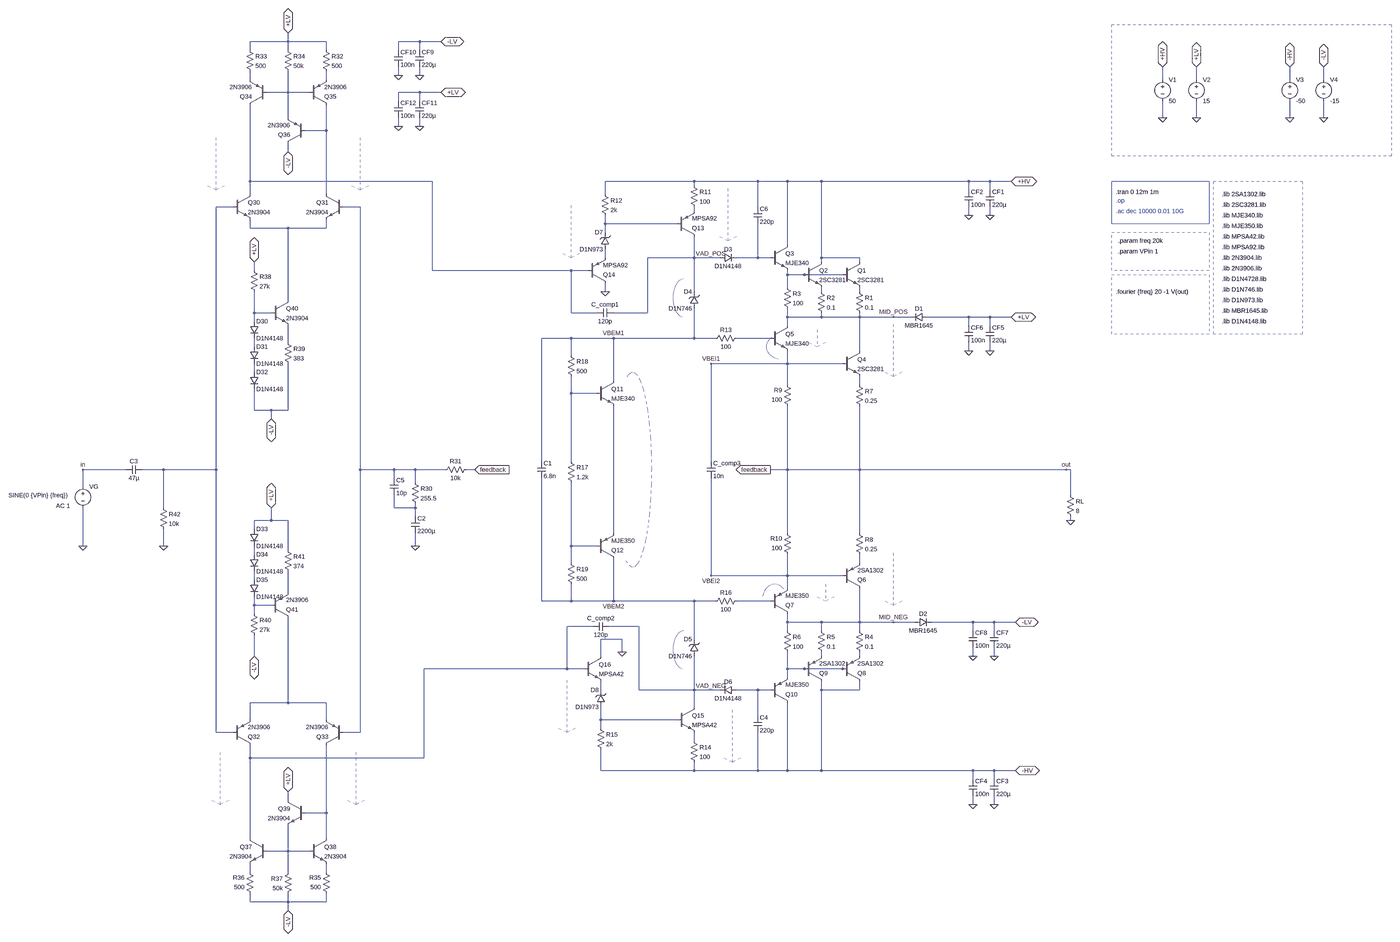
[diagram p0: schematic amplifier_V0.3.asc, whole sheet]
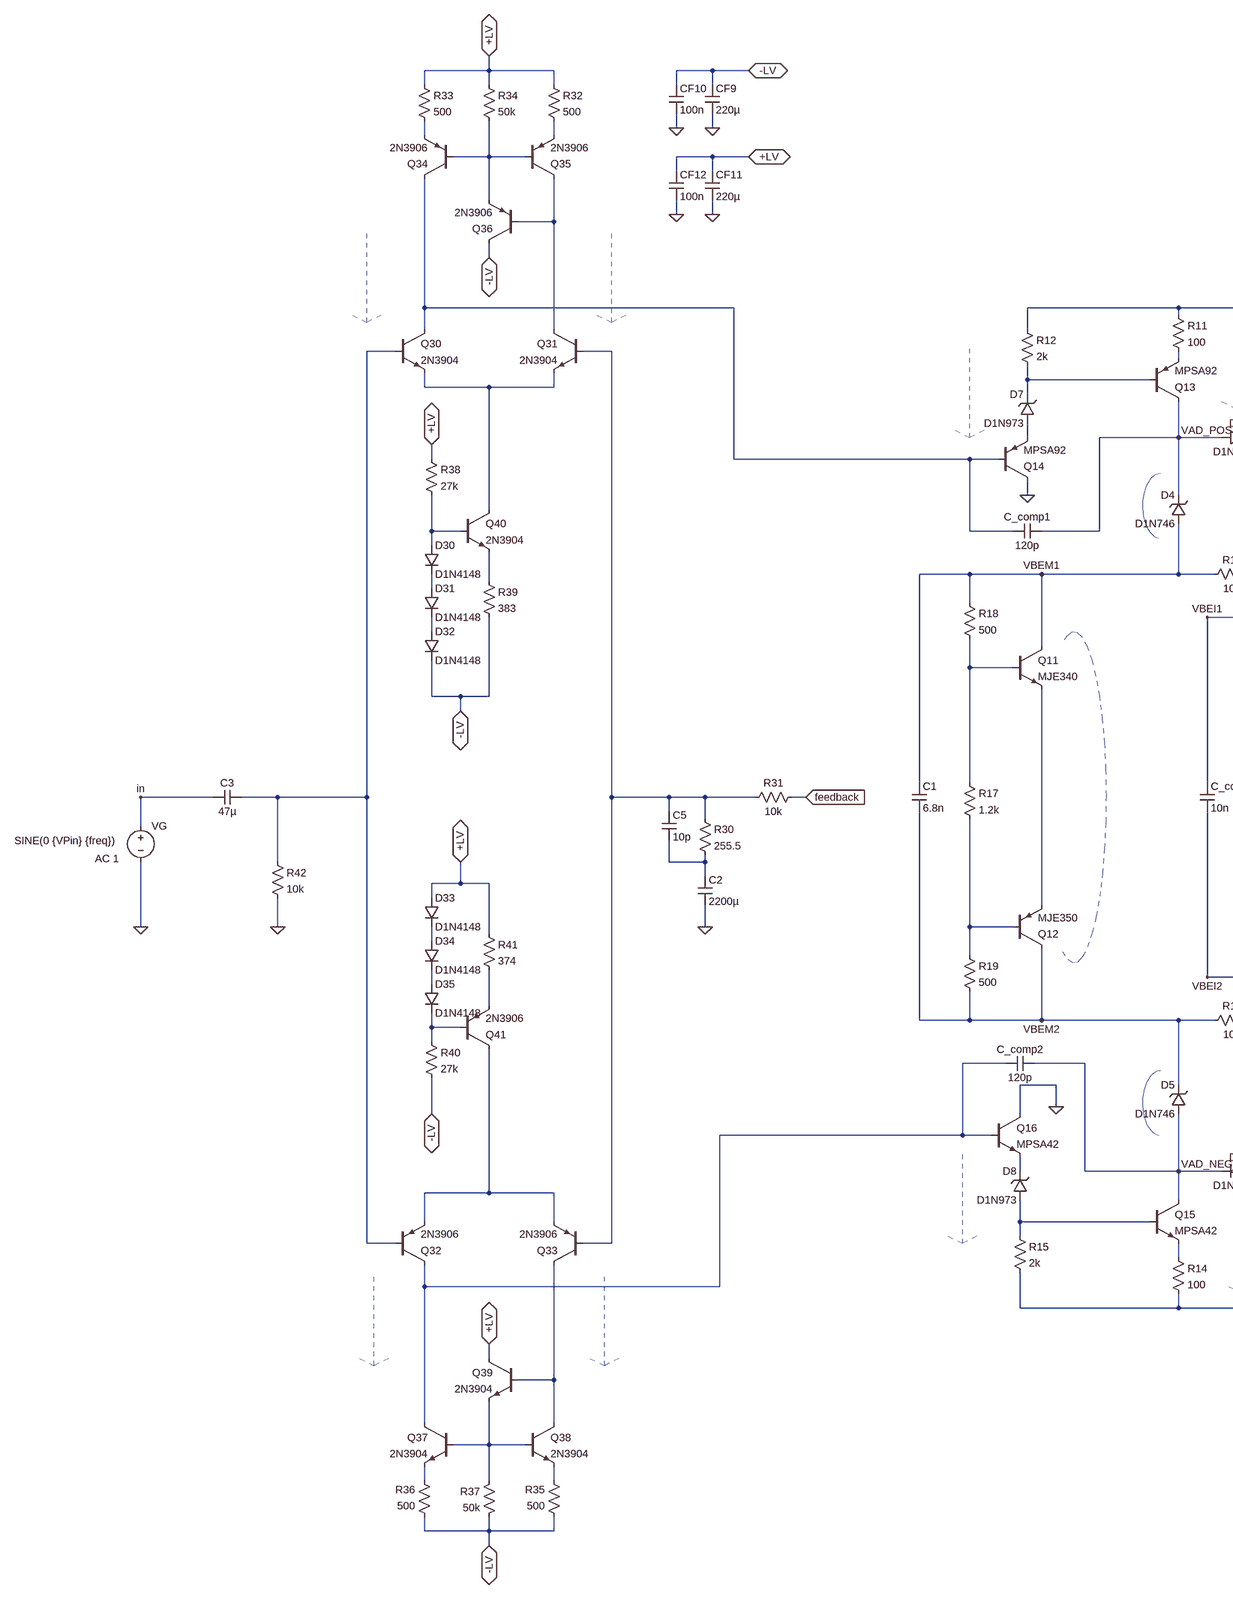
[diagram p1: schematic amplifier_V0.3.asc, part, row 1 of 1, column 1 of 2]
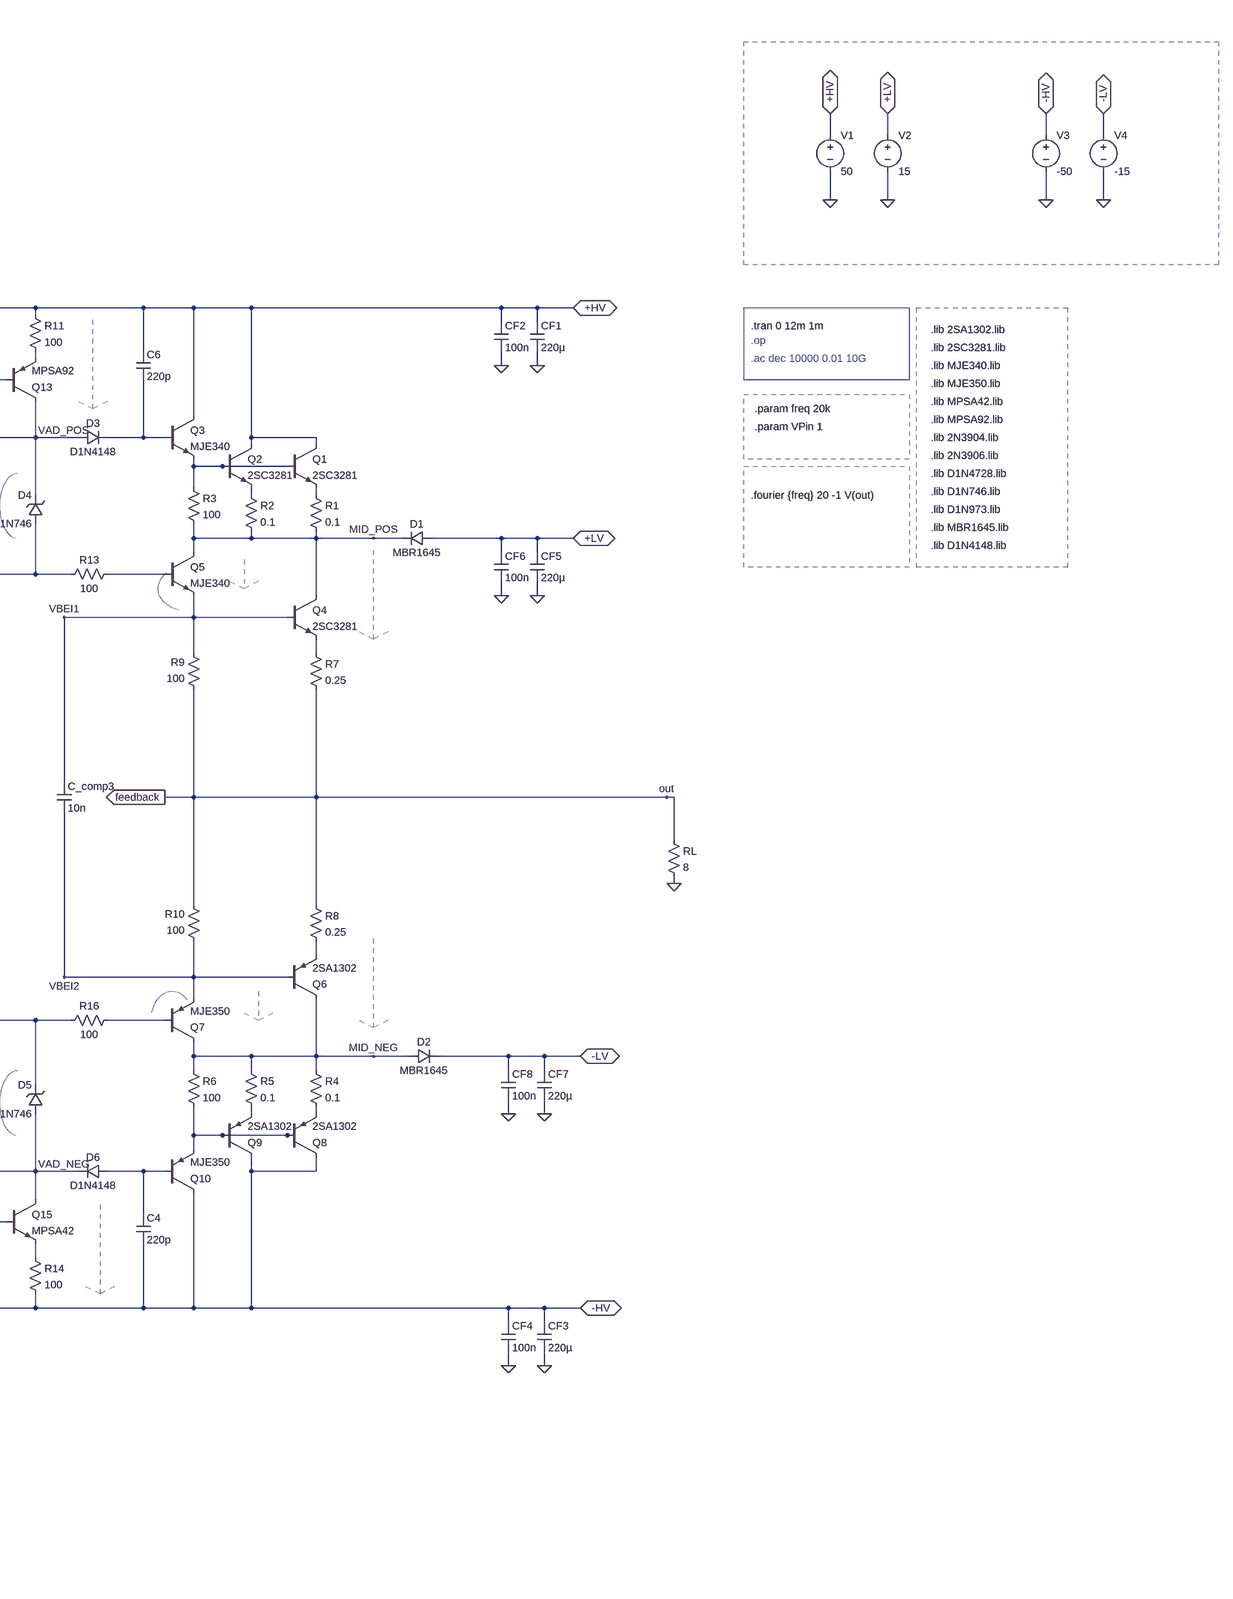
[diagram p2: schematic amplifier_V0.3.asc, part, row 1 of 1, column 2 of 2]
amplifier_V0.3.asc, the LTspice schematic file:
Version 4
SHEET 1 2964 1888
WIRE -2016 -1488 -2016 -1520
WIRE -2016 -1488 -2160 -1488
WIRE -1872 -1488 -2016 -1488
WIRE -1520 -1488 -1600 -1488
WIRE -1440 -1488 -1520 -1488
WIRE -2160 -1456 -2160 -1488
WIRE -2016 -1456 -2016 -1488
WIRE -1872 -1456 -1872 -1488
WIRE -1600 -1456 -1600 -1488
WIRE -1520 -1456 -1520 -1488
WIRE -1600 -1360 -1600 -1392
WIRE -1520 -1360 -1520 -1392
WIRE -2160 -1344 -2160 -1376
WIRE -1872 -1344 -1872 -1376
WIRE 1920 -1344 1920 -1392
WIRE 2048 -1344 2048 -1392
WIRE 2400 -1344 2400 -1392
WIRE 2528 -1344 2528 -1392
WIRE -2016 -1296 -2016 -1376
WIRE -2016 -1296 -2096 -1296
WIRE -1936 -1296 -2016 -1296
WIRE -1520 -1296 -1600 -1296
WIRE -1440 -1296 -1520 -1296
WIRE -1600 -1264 -1600 -1296
WIRE -1520 -1264 -1520 -1296
WIRE -2016 -1200 -2016 -1296
WIRE 1920 -1200 1920 -1264
WIRE 2048 -1200 2048 -1264
WIRE 2400 -1200 2400 -1264
WIRE 2528 -1200 2528 -1264
WIRE -1600 -1168 -1600 -1200
WIRE -1520 -1168 -1520 -1200
WIRE -1872 -1152 -1872 -1248
WIRE -1872 -1152 -1952 -1152
WIRE -2016 -1072 -2016 -1104
WIRE -2160 -960 -2160 -1248
WIRE -1472 -960 -2160 -960
WIRE -304 -960 -640 -960
WIRE -64 -960 -304 -960
WIRE 48 -960 -64 -960
WIRE 176 -960 48 -960
WIRE 912 -960 176 -960
WIRE 992 -960 912 -960
WIRE 1072 -960 992 -960
WIRE -304 -944 -304 -960
WIRE 912 -928 912 -960
WIRE 992 -928 992 -960
WIRE -2160 -912 -2160 -960
WIRE -1872 -912 -1872 -1152
WIRE -640 -912 -640 -960
WIRE -2224 -864 -2288 -864
WIRE -1744 -864 -1808 -864
WIRE -64 -864 -64 -960
WIRE -304 -848 -304 -864
WIRE 912 -832 912 -864
WIRE 992 -832 992 -864
WIRE -640 -800 -640 -832
WIRE -368 -800 -640 -800
WIRE -2160 -784 -2160 -816
WIRE -2016 -784 -2160 -784
WIRE -1872 -784 -1872 -816
WIRE -1872 -784 -2016 -784
WIRE -640 -768 -640 -800
WIRE 48 -720 48 -960
WIRE -640 -672 -640 -704
WIRE -304 -672 -304 -752
WIRE -304 -672 -480 -672
WIRE -208 -672 -304 -672
WIRE -64 -672 -64 -800
WIRE -64 -672 -144 -672
WIRE -16 -672 -64 -672
WIRE 176 -672 176 -960
WIRE 320 -672 176 -672
WIRE 176 -656 176 -672
WIRE 320 -656 320 -672
WIRE -2144 -624 -2144 -656
WIRE -1472 -624 -1472 -960
WIRE -768 -624 -1472 -624
WIRE -704 -624 -768 -624
WIRE 48 -608 48 -624
WIRE 112 -608 48 -608
WIRE 256 -608 112 -608
WIRE 48 -560 48 -608
WIRE -640 -544 -640 -576
WIRE -304 -544 -304 -672
WIRE 176 -544 176 -560
WIRE 320 -544 320 -560
WIRE -2016 -512 -2016 -784
WIRE -2144 -464 -2144 -544
WIRE -2080 -464 -2144 -464
WIRE -768 -464 -768 -624
WIRE -672 -464 -768 -464
WIRE -480 -464 -480 -672
WIRE -480 -464 -608 -464
WIRE 48 -448 48 -480
WIRE 176 -448 176 -464
WIRE 176 -448 48 -448
WIRE 320 -448 320 -464
WIRE 320 -448 176 -448
WIRE 448 -448 320 -448
WIRE 512 -448 448 -448
WIRE 912 -448 576 -448
WIRE 992 -448 912 -448
WIRE 1072 -448 992 -448
WIRE -2144 -432 -2144 -464
WIRE 48 -416 48 -448
WIRE 912 -416 912 -448
WIRE 992 -416 992 -448
WIRE -768 -368 -880 -368
WIRE -608 -368 -768 -368
WIRE -304 -368 -304 -480
WIRE -304 -368 -608 -368
WIRE -224 -368 -304 -368
WIRE -16 -368 -144 -368
WIRE -2016 -352 -2016 -416
WIRE -2144 -336 -2144 -368
WIRE 320 -320 320 -448
WIRE 912 -320 912 -352
WIRE 992 -320 992 -352
WIRE -768 -304 -768 -368
WIRE 48 -272 48 -320
WIRE 48 -272 -240 -272
WIRE 256 -272 48 -272
WIRE -2144 -240 -2144 -272
WIRE -608 -208 -608 -368
WIRE 48 -192 48 -272
WIRE 320 -192 320 -224
WIRE -768 -160 -768 -224
WIRE -672 -160 -768 -160
WIRE -2144 -96 -2144 -176
WIRE -2080 -96 -2144 -96
WIRE -2016 -96 -2016 -272
WIRE -2016 -96 -2080 -96
WIRE -2080 -64 -2080 -96
WIRE -880 96 -880 -368
WIRE -768 96 -768 -160
WIRE -240 96 -240 -272
WIRE -2640 128 -2912 128
WIRE -2496 128 -2576 128
WIRE -2288 128 -2288 -864
WIRE -2288 128 -2496 128
WIRE -1744 128 -1744 -864
WIRE -1616 128 -1744 128
WIRE -1536 128 -1616 128
WIRE -1424 128 -1536 128
WIRE -1312 128 -1344 128
WIRE 48 128 48 -112
WIRE 48 128 -16 128
WIRE 320 128 320 -112
WIRE 320 128 48 128
WIRE 1280 128 320 128
WIRE 1296 128 1280 128
WIRE -1616 160 -1616 128
WIRE -1536 176 -1536 128
WIRE -2912 192 -2912 128
WIRE 1296 224 1296 128
WIRE -2496 272 -2496 128
WIRE -1616 272 -1616 224
WIRE -1536 272 -1536 256
WIRE -1536 272 -1616 272
WIRE -1536 304 -1536 272
WIRE -2080 320 -2080 272
WIRE -2080 320 -2144 320
WIRE -2016 320 -2080 320
WIRE 1296 320 1296 304
WIRE -2144 352 -2144 320
WIRE -608 368 -608 -112
WIRE 48 368 48 128
WIRE 320 368 320 128
WIRE -2912 416 -2912 272
WIRE -2496 416 -2496 352
WIRE -1536 416 -1536 368
WIRE -768 416 -768 176
WIRE -672 416 -768 416
WIRE -2016 432 -2016 320
WIRE -2144 448 -2144 416
WIRE -768 480 -768 416
WIRE 320 480 320 448
WIRE -240 528 -240 160
WIRE 48 528 48 448
WIRE 48 528 -240 528
WIRE 256 528 48 528
WIRE -2144 544 -2144 512
WIRE 48 576 48 528
WIRE -2016 592 -2016 512
WIRE -880 624 -880 160
WIRE -768 624 -768 560
WIRE -768 624 -880 624
WIRE -608 624 -608 464
WIRE -608 624 -768 624
WIRE -304 624 -608 624
WIRE -224 624 -304 624
WIRE -16 624 -144 624
WIRE -2144 640 -2144 608
WIRE -2080 640 -2144 640
WIRE -2144 672 -2144 640
WIRE 48 704 48 672
WIRE 176 704 48 704
WIRE 320 704 320 576
WIRE 320 704 176 704
WIRE 448 704 320 704
WIRE 528 704 448 704
WIRE 928 704 592 704
WIRE 1008 704 928 704
WIRE 1088 704 1008 704
WIRE -688 720 -784 720
WIRE -512 720 -624 720
WIRE 48 736 48 704
WIRE 176 736 176 704
WIRE 320 736 320 704
WIRE 928 736 928 704
WIRE 1008 736 1008 704
WIRE -576 768 -656 768
WIRE -304 768 -304 624
WIRE -576 816 -576 768
WIRE -2144 832 -2144 752
WIRE -656 832 -656 768
WIRE 176 832 176 816
WIRE 320 832 320 816
WIRE 928 832 928 800
WIRE 1008 832 1008 800
WIRE -784 880 -784 720
WIRE -784 880 -1504 880
WIRE -720 880 -784 880
WIRE 48 880 48 816
WIRE 112 880 48 880
WIRE 256 880 112 880
WIRE 272 880 256 880
WIRE 48 912 48 880
WIRE -656 960 -656 928
WIRE -512 960 -512 720
WIRE -304 960 -304 832
WIRE -304 960 -512 960
WIRE -208 960 -304 960
WIRE -64 960 -144 960
WIRE -16 960 -64 960
WIRE 176 960 176 928
WIRE 320 960 320 928
WIRE 320 960 176 960
WIRE -2016 1008 -2016 688
WIRE -2016 1008 -2160 1008
WIRE -1872 1008 -2016 1008
WIRE -304 1024 -304 960
WIRE -64 1056 -64 960
WIRE -2160 1072 -2160 1008
WIRE -1872 1072 -1872 1008
WIRE -656 1072 -656 1024
WIRE -368 1072 -656 1072
WIRE -656 1104 -656 1072
WIRE -2288 1120 -2288 128
WIRE -2224 1120 -2288 1120
WIRE -1744 1120 -1744 128
WIRE -1744 1120 -1808 1120
WIRE -304 1152 -304 1120
WIRE -2160 1216 -2160 1168
WIRE -1504 1216 -1504 880
WIRE -1504 1216 -2160 1216
WIRE -656 1264 -656 1184
WIRE -304 1264 -304 1232
WIRE -304 1264 -656 1264
WIRE -64 1264 -64 1120
WIRE -64 1264 -304 1264
WIRE 48 1264 48 1008
WIRE 48 1264 -64 1264
WIRE 176 1264 176 960
WIRE 176 1264 48 1264
WIRE 928 1264 176 1264
WIRE 1008 1264 928 1264
WIRE 1088 1264 1008 1264
WIRE 928 1296 928 1264
WIRE 1008 1296 1008 1264
WIRE -2016 1376 -2016 1344
WIRE 928 1392 928 1360
WIRE 1008 1392 1008 1360
WIRE -1872 1424 -1872 1168
WIRE -1872 1424 -1952 1424
WIRE -2160 1520 -2160 1216
WIRE -1872 1520 -1872 1424
WIRE -2016 1568 -2016 1472
WIRE -2016 1568 -2096 1568
WIRE -1936 1568 -2016 1568
WIRE -2160 1648 -2160 1616
WIRE -2016 1648 -2016 1568
WIRE -1872 1648 -1872 1616
WIRE -2160 1760 -2160 1728
WIRE -2016 1760 -2016 1728
WIRE -2016 1760 -2160 1760
WIRE -1872 1760 -1872 1728
WIRE -1872 1760 -2016 1760
WIRE -2016 1792 -2016 1760
FLAG 1088 1264 -HV
IOPIN 1088 1264 BiDir
FLAG 1088 704 -LV
IOPIN 1088 704 BiDir
FLAG 1072 -960 +HV
IOPIN 1072 -960 BiDir
FLAG 1072 -448 +LV
IOPIN 1072 -448 BiDir
FLAG 1296 320 0
FLAG 1920 -1200 0
FLAG 2048 -1200 0
FLAG 2400 -1200 0
FLAG 2528 -1200 0
FLAG 1920 -1392 +HV
IOPIN 1920 -1392 BiDir
FLAG 2048 -1392 +LV
IOPIN 2048 -1392 BiDir
FLAG 2400 -1392 -HV
IOPIN 2400 -1392 BiDir
FLAG 2528 -1392 -LV
IOPIN 2528 -1392 BiDir
FLAG -608 -368 VBEM1
FLAG -608 624 VBEM2
FLAG 1280 128 out
FLAG -304 -672 VAD_POS
FLAG -304 960 VAD_NEG
FLAG 448 704 MID_NEG
FLAG 448 -448 MID_POS
FLAG -240 -272 VBEI1
FLAG -240 528 VBEI2
FLAG -2496 416 0
FLAG -1536 416 0
FLAG -2912 416 0
FLAG -640 -544 0
FLAG -576 816 0
FLAG -2016 -1520 +LV
IOPIN -2016 -1520 BiDir
FLAG -2016 1792 -LV
IOPIN -2016 1792 BiDir
FLAG -2016 1344 +LV
IOPIN -2016 1344 BiDir
FLAG -2016 -1072 -LV
IOPIN -2016 -1072 BiDir
FLAG -2912 128 in
FLAG -16 128 feedback
IOPIN -16 128 Out
FLAG -1312 128 feedback
IOPIN -1312 128 In
FLAG -2144 -656 +LV
IOPIN -2144 -656 BiDir
FLAG -2080 -64 -LV
IOPIN -2080 -64 BiDir
FLAG -2080 272 +LV
IOPIN -2080 272 BiDir
FLAG -2144 832 -LV
IOPIN -2144 832 BiDir
FLAG 912 -832 0
FLAG 992 -832 0
FLAG 928 1392 0
FLAG 1008 1392 0
FLAG 912 -320 0
FLAG 992 -320 0
FLAG 928 832 0
FLAG 1008 832 0
FLAG -1440 -1488 -LV
IOPIN -1440 -1488 BiDir
FLAG -1600 -1360 0
FLAG -1520 -1360 0
FLAG -1440 -1296 +LV
IOPIN -1440 -1296 BiDir
FLAG -1600 -1168 0
FLAG -1520 -1168 0
DATAFLAG 96 704 "round($*100)/100"
DATAFLAG 1184 128 ""
DATAFLAG 448 -304 "Ic(Q4)"
DATAFLAG 448 560 "-Ic(Q6)"
DATAFLAG -464 128 "V(vbem1)-V(vbem2)"
DATAFLAG 160 -368 "-Ie(Q5)"
DATAFLAG 192 592 "Ie(Q7)"
DATAFLAG -608 -288 "Ic(Q13)"
DATAFLAG -608 544 "Ic(Q12)"
DATAFLAG -384 -512 "V(vad_pos)-V(vbem1)"
DATAFLAG -384 816 "-(V(vad_neg)-V(vbem2))"
DATAFLAG -16 -304 "V(vbem1)-V(vbei1)"
DATAFLAG -32 576 "-(V(vbem2)-V(vbei2))"
DATAFLAG -448 624 ""
DATAFLAG -464 -368 ""
DATAFLAG -176 -832 "-Ic(Q13)"
DATAFLAG -160 1136 "Ic(Q15)"
DATAFLAG -768 -768 "Ie(Q14)"
DATAFLAG -480 1072 ""
DATAFLAG -784 1008 "-Ie(Q16)"
DATAFLAG -928 -624 ""
DATAFLAG -1008 880 ""
DATAFLAG -416 -672 ""
DATAFLAG -1744 -1024 "Ic(Q31)"
DATAFLAG -2288 -1024 "Ic(Q30)"
DATAFLAG -2016 -784 ""
DATAFLAG -2272 1296 "-Ic(Q32)"
DATAFLAG -2016 1008 ""
DATAFLAG -2160 1328 ""
DATAFLAG -1760 1296 "-Ic(Q33)"
DATAFLAG -1872 1344 ""
DATAFLAG -2160 -1040 ""
DATAFLAG -1872 -1040 ""
DATAFLAG -2000 -1296 ""
DATAFLAG -2016 -592 "Ic(Q40)"
DATAFLAG -2016 816 "-Ic(Q41)"
DATAFLAG -480 -800 ""
SYMBOL npn -16 -720 R0
SYMATTR InstName Q3
SYMATTR Value MJE340
SYMBOL res 32 -576 R0
SYMATTR InstName R3
SYMATTR Value 100
SYMBOL diode -208 -656 R270
WINDOW 0 32 32 VTop 2
WINDOW 3 0 32 VBottom 2
SYMATTR InstName D3
SYMATTR Value D1N4148
SYMBOL zener -288 -480 R180
WINDOW 0 24 64 Left 2
WINDOW 3 24 0 Left 2
SYMATTR InstName D4
SYMATTR Value D1N746
SYMBOL npn -16 -416 R0
SYMATTR InstName Q5
SYMATTR Value MJE340
SYMBOL res 304 -208 R0
SYMATTR InstName R7
SYMATTR Value 0.25
SYMBOL res 64 -96 R180
WINDOW 0 36 76 Left 2
WINDOW 3 36 40 Left 2
SYMATTR InstName R9
SYMATTR Value 100
SYMBOL res 304 352 R0
SYMATTR InstName R8
SYMATTR Value 0.25
SYMBOL pnp -16 672 M180
SYMATTR InstName Q7
SYMATTR Value MJE350
SYMBOL pnp -16 1008 M180
SYMATTR InstName Q10
SYMATTR Value MJE350
SYMBOL res 32 720 R0
SYMATTR InstName R6
SYMATTR Value 100
SYMBOL zener -288 832 R180
WINDOW 0 24 64 Left 2
WINDOW 3 24 0 Left 2
SYMATTR InstName D5
SYMATTR Value D1N746
SYMBOL diode -144 944 R90
WINDOW 0 0 32 VBottom 2
WINDOW 3 32 32 VTop 2
SYMATTR InstName D6
SYMATTR Value D1N4148
SYMBOL diode 528 720 R270
WINDOW 0 32 32 VTop 2
WINDOW 3 0 32 VBottom 2
SYMATTR InstName D2
SYMATTR Value MBR1645
SYMBOL res 64 464 R180
WINDOW 0 36 76 Left 2
WINDOW 3 36 40 Left 2
SYMATTR InstName R10
SYMATTR Value 100
SYMBOL res 304 720 R0
SYMATTR InstName R4
SYMATTR Value 0.1
SYMBOL res 160 720 R0
SYMATTR InstName R5
SYMATTR Value 0.1
SYMBOL res 160 -560 R0
SYMATTR InstName R2
SYMATTR Value 0.1
SYMBOL res 304 -560 R0
SYMATTR InstName R1
SYMATTR Value 0.1
SYMBOL res 1280 208 R0
SYMATTR InstName RL
SYMATTR Value 8
SYMBOL diode 576 -432 M270
WINDOW 0 32 32 VTop 2
WINDOW 3 0 32 VBottom 2
SYMATTR InstName D1
SYMATTR Value MBR1645
SYMBOL voltage 1920 -1360 R0
SYMATTR InstName V1
SYMATTR Value 50
SYMBOL voltage 2048 -1360 R0
SYMATTR InstName V2
SYMATTR Value 15
SYMBOL voltage 2400 -1360 R0
SYMATTR InstName V3
SYMATTR Value -50
SYMBOL voltage 2528 -1360 R0
SYMATTR InstName V4
SYMATTR Value -15
SYMBOL pnp -672 464 M180
SYMATTR InstName Q12
SYMATTR Value MJE350
SYMBOL npn -672 -208 R0
SYMATTR InstName Q11
SYMATTR Value MJE340
SYMBOL res -784 80 R0
SYMATTR InstName R17
SYMATTR Value 1.2k
SYMBOL res -784 -320 R0
SYMATTR InstName R18
SYMATTR Value 500
SYMBOL res -784 464 R0
SYMATTR InstName R19
SYMATTR Value 500
SYMBOL cap -256 96 R0
SYMATTR InstName C_comp3
SYMATTR Value 10n
SYMBOL res -128 -384 R90
WINDOW 0 0 56 VBottom 2
WINDOW 3 32 56 VTop 2
SYMATTR InstName R13
SYMATTR Value 100
SYMBOL res -128 608 R90
WINDOW 0 0 56 VBottom 2
WINDOW 3 32 56 VTop 2
SYMATTR InstName R16
SYMATTR Value 100
SYMBOL pnp -368 -752 M180
SYMATTR InstName Q13
SYMATTR Value MPSA92
SYMBOL npn -368 1024 R0
SYMATTR InstName Q15
SYMATTR Value MPSA42
SYMBOL cap -896 96 R0
SYMATTR InstName C1
SYMATTR Value 6.8n
SYMBOL voltage -2912 176 R0
WINDOW 3 -281 49 Left 2
WINDOW 123 -102 89 Left 2
WINDOW 39 0 0 Left 2
SYMATTR Value SINE(0 {VPin} {freq})
SYMATTR Value2 AC 1
SYMATTR InstName VG
SYMBOL npn -720 832 R0
SYMATTR InstName Q16
SYMATTR Value MPSA42
SYMBOL res -672 1088 R0
SYMATTR InstName R15
SYMATTR Value 2k
SYMBOL res -1552 160 R0
SYMATTR InstName R30
SYMATTR Value 255.5
SYMBOL res -1328 112 R90
WINDOW 0 0 56 VBottom 2
WINDOW 3 32 56 VTop 2
SYMATTR InstName R31
SYMATTR Value 10k
SYMBOL res -2512 256 R0
SYMATTR InstName R42
SYMATTR Value 10k
SYMBOL cap -1552 304 R0
SYMATTR InstName C2
SYMATTR Value 2200µ
SYMBOL cap -2576 112 R90
WINDOW 0 0 32 VBottom 2
WINDOW 3 32 32 VTop 2
SYMATTR InstName C3
SYMATTR Value 47µ
SYMBOL pnp -704 -576 M180
SYMATTR InstName Q14
SYMATTR Value MPSA92
SYMBOL res -656 -928 R0
SYMATTR InstName R12
SYMATTR Value 2k
SYMBOL zener -640 1024 R180
WINDOW 0 24 64 Left 2
WINDOW 3 24 0 Left 2
SYMATTR InstName D8
SYMATTR Value D1N973
SYMBOL zener -624 -704 R180
WINDOW 0 24 64 Left 2
WINDOW 3 24 0 Left 2
SYMATTR InstName D7
SYMATTR Value D1N973
SYMBOL npn -2224 -912 R0
SYMATTR InstName Q30
SYMATTR Value 2N3904
SYMBOL npn -1808 -912 M0
SYMATTR InstName Q31
SYMATTR Value 2N3904
SYMBOL pnp -2224 1168 M180
SYMATTR InstName Q32
SYMATTR Value 2N3906
SYMBOL pnp -1808 1168 R180
SYMATTR InstName Q33
SYMATTR Value 2N3906
SYMBOL cap -608 -480 R90
WINDOW 0 0 32 VBottom 2
WINDOW 3 32 32 VTop 2
SYMATTR InstName C_comp1
SYMATTR Value 120p
SYMBOL cap -624 704 R90
WINDOW 0 0 32 VBottom 2
WINDOW 3 32 32 VTop 2
SYMATTR InstName C_comp2
SYMATTR Value 120p
SYMBOL pnp -1936 -1248 M180
SYMATTR InstName Q35
SYMATTR Value 2N3906
SYMBOL pnp -2096 -1248 R180
SYMATTR InstName Q34
SYMATTR Value 2N3906
SYMBOL npn -2096 1520 M0
SYMATTR InstName Q37
SYMATTR Value 2N3904
SYMBOL npn -1936 1520 R0
SYMATTR InstName Q38
SYMATTR Value 2N3904
SYMBOL res -320 -960 R0
SYMATTR InstName R11
SYMATTR Value 100
SYMBOL res -320 1136 R0
SYMATTR InstName R14
SYMATTR Value 100
SYMBOL res -2176 -1472 R0
SYMATTR InstName R33
SYMATTR Value 500
SYMBOL res -1888 -1472 R0
SYMATTR InstName R32
SYMATTR Value 500
SYMBOL res -1856 1744 R180
WINDOW 0 36 76 Left 2
WINDOW 3 36 40 Left 2
SYMATTR InstName R35
SYMATTR Value 500
SYMBOL res -2144 1744 R180
WINDOW 0 36 76 Left 2
WINDOW 3 36 40 Left 2
SYMATTR InstName R36
SYMATTR Value 500
SYMBOL npn -1952 1376 M0
SYMATTR InstName Q39
SYMATTR Value 2N3904
SYMBOL pnp -1952 -1104 R180
SYMATTR InstName Q36
SYMATTR Value 2N3906
SYMBOL res -2000 1632 M0
SYMATTR InstName R37
SYMATTR Value 50k
SYMBOL res -2032 -1472 R0
SYMATTR InstName R34
SYMATTR Value 50k
SYMBOL res -2160 -640 R0
SYMATTR InstName R38
SYMATTR Value 27k
SYMBOL npn -2080 -512 R0
SYMATTR InstName Q40
SYMATTR Value 2N3904
SYMBOL res -2032 -368 R0
SYMATTR InstName R39
SYMATTR Value 383
SYMBOL diode -2160 -432 R0
SYMATTR InstName D30
SYMATTR Value D1N4148
SYMBOL diode -2160 -336 R0
SYMATTR InstName D31
SYMATTR Value D1N4148
SYMBOL diode -2160 -240 R0
SYMATTR InstName D32
SYMATTR Value D1N4148
SYMBOL pnp -2080 688 M180
SYMATTR InstName Q41
SYMATTR Value 2N3906
SYMBOL res -2032 416 R0
SYMATTR InstName R41
SYMATTR Value 374
SYMBOL res -2160 656 R0
SYMATTR InstName R40
SYMATTR Value 27k
SYMBOL diode -2160 352 R0
SYMATTR InstName D33
SYMATTR Value D1N4148
SYMBOL diode -2160 448 R0
SYMATTR InstName D34
SYMATTR Value D1N4148
SYMBOL diode -2160 544 R0
SYMATTR InstName D35
SYMATTR Value D1N4148
SYMBOL npn 256 -656 R0
SYMATTR InstName Q1
SYMATTR Value 2SC3281
SYMBOL npn 112 -656 R0
SYMATTR InstName Q2
SYMATTR Value 2SC3281
SYMBOL npn 256 -320 R0
SYMATTR InstName Q4
SYMATTR Value 2SC3281
SYMBOL pnp 256 576 M180
SYMATTR InstName Q6
SYMATTR Value 2SA1302
SYMBOL pnp 256 928 M180
SYMATTR InstName Q8
SYMATTR Value 2SA1302
SYMBOL pnp 112 928 M180
SYMATTR InstName Q9
SYMATTR Value 2SA1302
SYMBOL cap 976 -928 R0
SYMATTR InstName CF1
SYMATTR Value 220µ
SYMBOL cap 896 -928 R0
SYMATTR InstName CF2
SYMATTR Value 100n
SYMBOL cap 992 1296 R0
SYMATTR InstName CF3
SYMATTR Value 220µ
SYMBOL cap 912 1296 R0
SYMATTR InstName CF4
SYMATTR Value 100n
SYMBOL cap 976 -416 R0
SYMATTR InstName CF5
SYMATTR Value 220µ
SYMBOL cap 896 -416 R0
SYMATTR InstName CF6
SYMATTR Value 100n
SYMBOL cap 992 736 R0
SYMATTR InstName CF7
SYMATTR Value 220µ
SYMBOL cap 912 736 R0
SYMATTR InstName CF8
SYMATTR Value 100n
SYMBOL cap -1536 -1456 R0
SYMATTR InstName CF9
SYMATTR Value 220µ
SYMBOL cap -1616 -1456 R0
SYMATTR InstName CF10
SYMATTR Value 100n
SYMBOL cap -1536 -1264 R0
SYMATTR InstName CF11
SYMATTR Value 220µ
SYMBOL cap -1616 -1264 R0
SYMATTR InstName CF12
SYMATTR Value 100n
SYMBOL cap -1632 160 R0
SYMATTR InstName C5
SYMATTR Value 10p
SYMBOL cap -80 1056 R0
SYMATTR InstName C4
SYMATTR Value 220p
SYMBOL cap -80 -864 R0
SYMATTR InstName C6
SYMATTR Value 220p
TEXT 1744 -920 Left 2 !.tran 0 12m 1m
TEXT 1752 -736 Left 2 !.param freq 20k
TEXT 1744 -888 Left 2 ;.op
TEXT 1744 -544 Left 2 !.fourier {freq} 20 -1 V(out)
TEXT 2144 -912 Left 2 !.lib 2SA1302.lib
TEXT 2144 -872 Left 2 !.lib 2SC3281.lib
TEXT 2144 -592 Left 2 !.lib D1N4728.lib
TEXT 2144 -472 Left 2 !.lib MBR1645.lib
TEXT 2144 -832 Left 2 !.lib MJE340.lib
TEXT 2144 -792 Left 2 !.lib MJE350.lib
TEXT 2144 -432 Left 2 !.lib D1N4148.lib
TEXT 2144 -752 Left 2 !.lib MPSA42.lib
TEXT 2144 -712 Left 2 !.lib MPSA92.lib
TEXT 2144 -552 Left 2 !.lib D1N746.lib
TEXT 2144 -512 Left 2 !.lib D1N973.lib
TEXT 1744 -848 Left 2 ;.ac dec 10000 0.01 10G
TEXT 2144 -672 Left 2 !.lib 2N3904.lib
TEXT 2144 -632 Left 2 !.lib 2N3906.lib
TEXT 1752 -696 Left 2 !.param VPin 1
LINE Normal -768 -672 -768 -880 2
LINE Normal -736 -688 -768 -672 2
LINE Normal -800 -688 -768 -672 2
LINE Normal -784 1120 -784 912 2
LINE Normal -752 1104 -784 1120 2
LINE Normal -816 1104 -784 1120 2
LINE Normal 448 -224 448 -432 2
LINE Normal 480 -240 448 -224 2
LINE Normal 416 -240 448 -224 2
LINE Normal 448 640 448 432 2
LINE Normal 480 624 448 640 2
LINE Normal 416 624 448 640 2
LINE Normal -176 -736 -176 -944 2
LINE Normal -144 -752 -176 -736 2
LINE Normal -208 -752 -176 -736 2
LINE Normal -160 1232 -160 1024 2
LINE Normal -128 1216 -160 1232 2
LINE Normal -192 1216 -160 1232 2
LINE Normal 192 -352 160 -336 2
LINE Normal 128 -352 160 -336 2
LINE Normal 160 -400 160 -336 2
LINE Normal 224 608 192 624 2
LINE Normal 160 608 192 624 2
LINE Normal 192 560 192 624 2
LINE Normal -1744 -928 -1744 -1136 2
LINE Normal -1712 -944 -1744 -928 2
LINE Normal -1776 -944 -1744 -928 2
LINE Normal -2288 -928 -2288 -1136 2
LINE Normal -2256 -944 -2288 -928 2
LINE Normal -2320 -944 -2288 -928 2
LINE Normal -2272 1392 -2272 1184 2
LINE Normal -2240 1376 -2272 1392 2
LINE Normal -2304 1376 -2272 1392 2
LINE Normal -1760 1392 -1760 1184 2
LINE Normal -1728 1376 -1760 1392 2
LINE Normal -1792 1376 -1760 1392 2
RECTANGLE Normal 2096 -800 1728 -960
RECTANGLE Normal 2096 -624 1728 -768 3
RECTANGLE Normal 2096 -384 1728 -608 4
RECTANGLE Normal 2784 -1056 1728 -1552 4
RECTANGLE Normal 2448 -384 2112 -960 2
ARC Normal -32 -384 96 -288 -29 -382 0 -253 3
ARC Normal 48 560 -48 688 46 563 -83 592 3
ARC Normal -608 -240 -464 496 -563 485 -565 -235 2
ARC Normal -304 736 -384 880 -344 728 -348 886 2
ARC Normal -304 -592 -384 -448 -344 -600 -348 -442 2

The netlist it stands for:
* amplifier_V0.3.asc
Q3 +HV N012 N013 0 MJE340
R3 N013 MID_POS 100
D3 VAD_POS N012 D1N4148
D4 VBEM1 VAD_POS D1N746
Q5 MID_POS N017 VBEI1 0 MJE340
R7 N021 feedback 0.25
R9 feedback VBEI1 100
R8 feedback N027 0.25
Q7 MID_NEG N030 VBEI2 0 MJE350
Q10 -HV N037 N035 0 MJE350
R6 MID_NEG N035 100
D5 VAD_NEG VBEM2 D1N746
D6 N037 VAD_NEG D1N4148
D2 MID_NEG -LV MBR1645
R10 VBEI2 feedback 100
R4 MID_NEG N034 0.1
R5 MID_NEG N033 0.1
R2 N014 MID_POS 0.1
R1 N015 MID_POS 0.1
RL feedback 0 8
D1 +LV MID_POS MBR1645
V1 +HV 0 50
V2 +LV 0 15
V3 -HV 0 -50
V4 -LV 0 -15
Q12 VBEM2 N025 N024 0 MJE350
Q11 VBEM1 N022 N024 0 MJE340
R17 N022 N025 1.2k
R18 VBEM1 N022 500
R19 N025 VBEM2 500
C_comp3 VBEI1 VBEI2 10n
R13 N017 VBEM1 100
R16 N030 VBEM2 100
Q13 VAD_POS N009 N008 0 MPSA92
Q15 VAD_NEG N039 N040 0 MPSA42
C1 VBEM1 VBEM2 6.8n
VG in 0 SINE(0 {VPin} {freq}) AC 1
Q16 0 N032 N036 0 MPSA42
R15 N039 -HV 2k
R30 N007 N023 255.5
R31 feedback N007 10k
R42 N006 0 10k
C2 N023 0 2200µ
C3 N006 in 47µ
Q14 0 N005 N011 0 MPSA92
R12 +HV N009 2k
D8 N039 N036 D1N973
D7 N011 N009 D1N973
Q30 N005 N006 N010 0 2N3904
Q31 N004 N007 N010 0 2N3904
Q32 N032 N006 N038 0 2N3906
Q33 N041 N007 N038 0 2N3906
C_comp1 VAD_POS N005 120p
C_comp2 VAD_NEG N032 120p
Q35 N004 N003 N002 0 2N3906
Q34 N005 N003 N001 0 2N3906
Q37 N032 N042 N043 0 2N3904
Q38 N041 N042 N044 0 2N3904
R11 +HV N008 100
R14 N040 -HV 100
R33 +LV N001 500
R32 +LV N002 500
R35 -LV N044 500
R36 -LV N043 500
Q39 +LV N041 N042 0 2N3904
Q36 -LV N004 N003 0 2N3906
R37 N042 -LV 50k
R34 +LV N003 50k
R38 +LV N016 27k
Q40 N010 N016 N018 0 2N3904
R39 N018 -LV 383
D30 N016 N019 D1N4148
D31 N019 N020 D1N4148
D32 N020 -LV D1N4148
Q41 N038 N031 N029 0 2N3906
R41 +LV N029 374
R40 N031 -LV 27k
D33 +LV N026 D1N4148
D34 N026 N028 D1N4148
D35 N028 N031 D1N4148
Q1 +HV N013 N015 0 2SC3281
Q2 +HV N013 N014 0 2SC3281
Q4 MID_POS VBEI1 N021 0 2SC3281
Q6 MID_NEG VBEI2 N027 0 2SA1302
Q8 -HV N035 N034 0 2SA1302
Q9 -HV N035 N033 0 2SA1302
CF1 +HV 0 220µ
CF2 +HV 0 100n
CF3 -HV 0 220µ
CF4 -HV 0 100n
CF5 +LV 0 220µ
CF6 +LV 0 100n
CF7 -LV 0 220µ
CF8 -LV 0 100n
CF9 -LV 0 220µ
CF10 -LV 0 100n
CF11 +LV 0 220µ
CF12 +LV 0 100n
C5 N007 N023 10p
C4 N037 -HV 220p
C6 +HV N012 220p
.model D D
.lib standard.dio
.model NPN NPN
.model PNP PNP
.lib standard.bjt
.tran 0 12m 1m
.param freq 20k
* .op
.fourier {freq} 20 -1 V(out)
.lib 2SA1302.lib
.lib 2SC3281.lib
.lib D1N4728.lib
.lib MBR1645.lib
.lib MJE340.lib
.lib MJE350.lib
.lib D1N4148.lib
.lib MPSA42.lib
.lib MPSA92.lib
.lib D1N746.lib
.lib D1N973.lib
* .ac dec 10000 0.01 10G
.lib 2N3904.lib
.lib 2N3906.lib
.param VPin 1
.backanno
.end